# EAGLE schematic PCB (EAGLE 9.6.2)
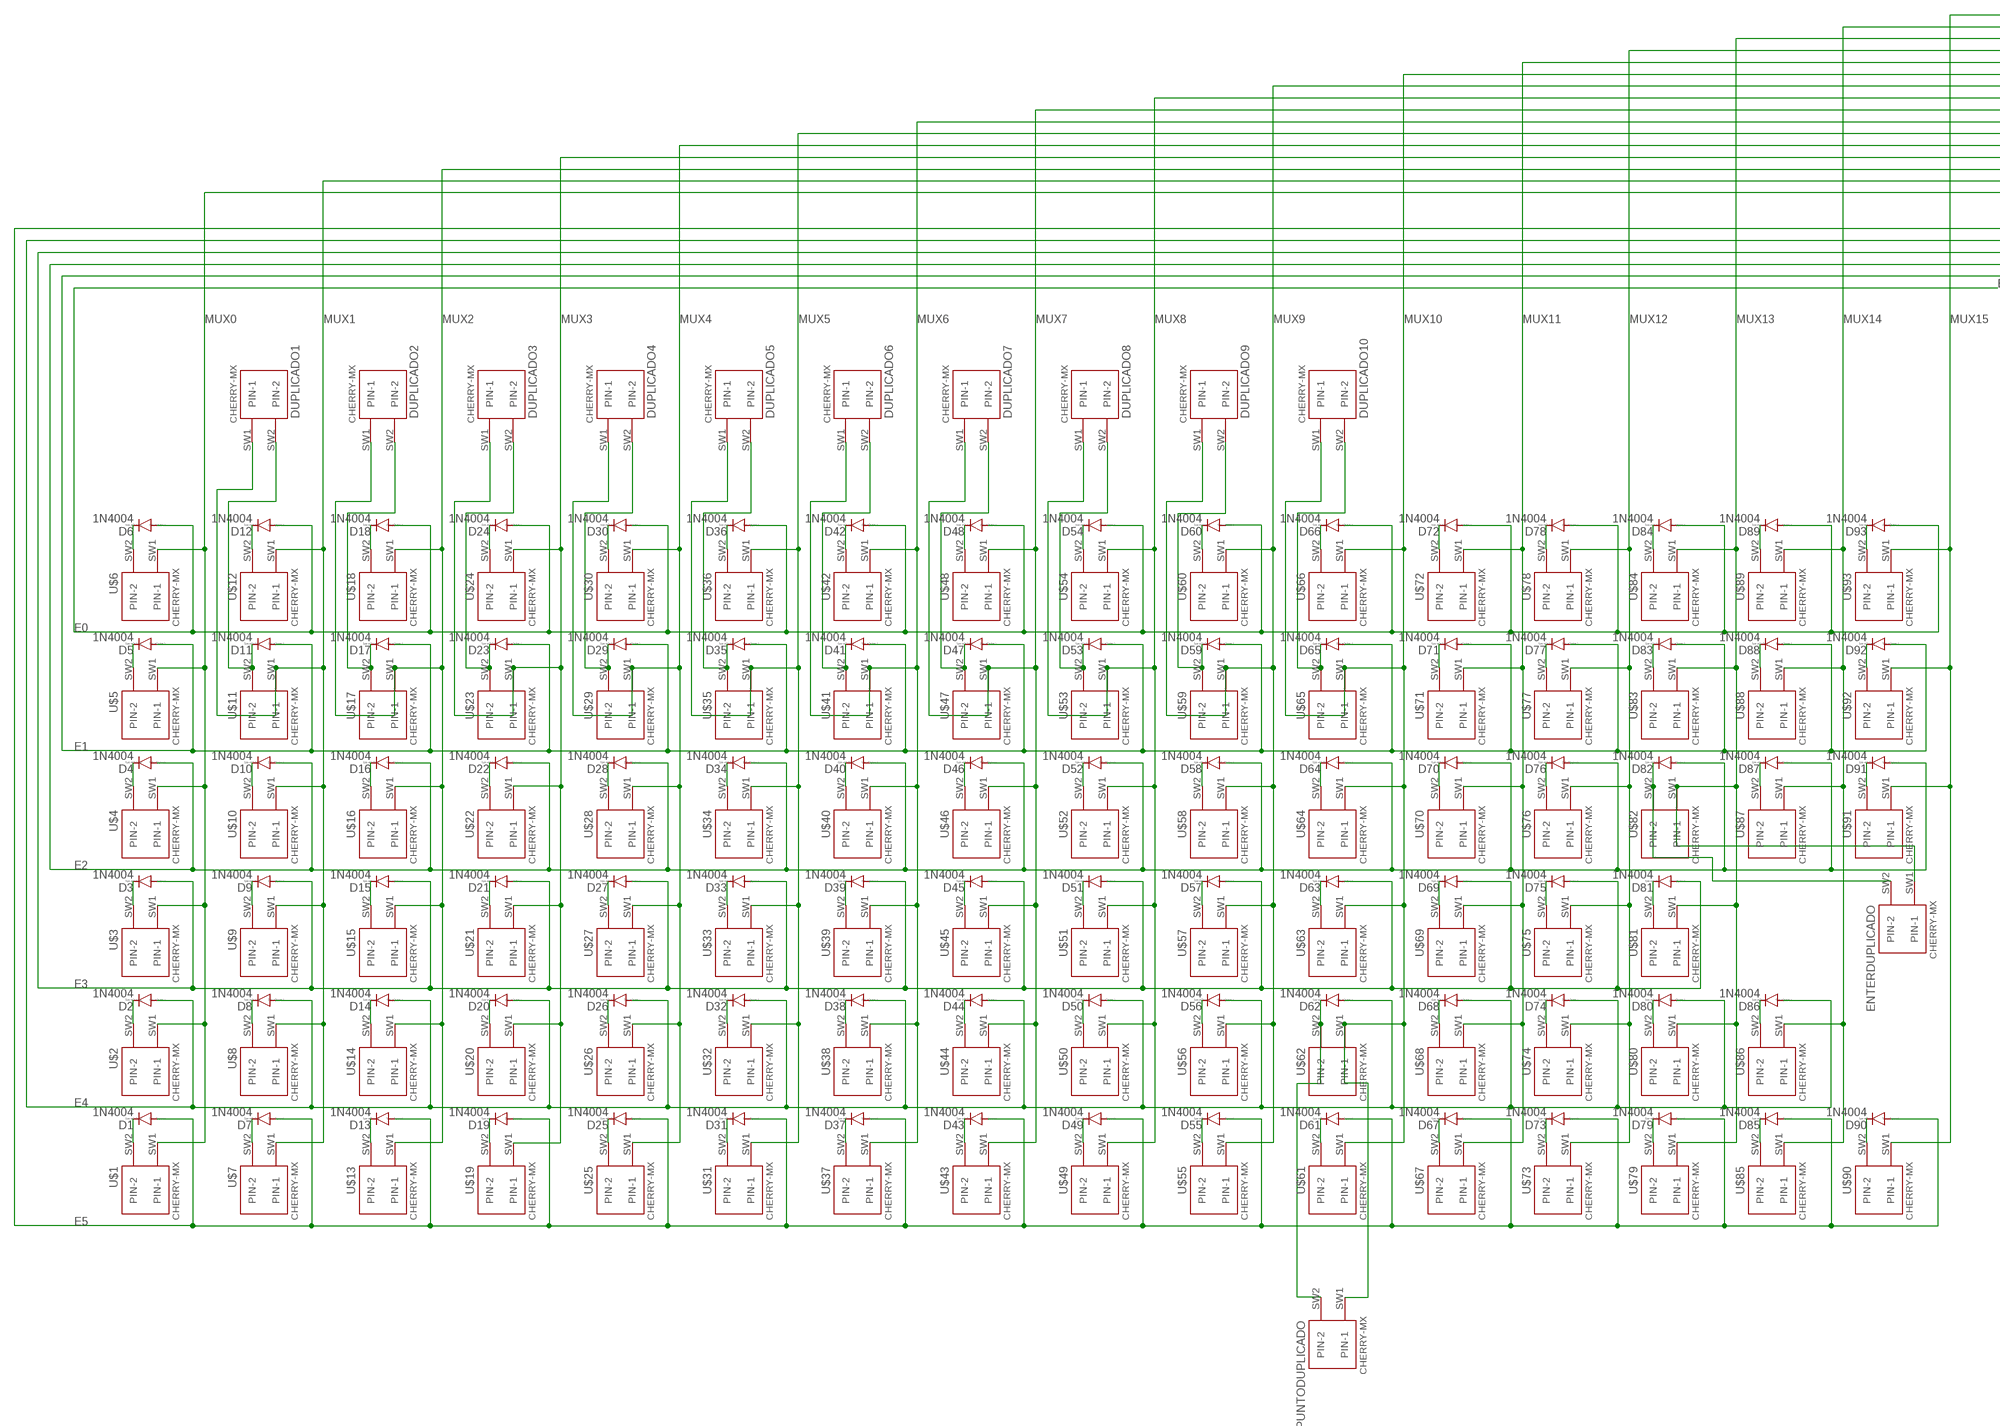
[diagram p0: schematic, sheet 1, part 1 of 2]
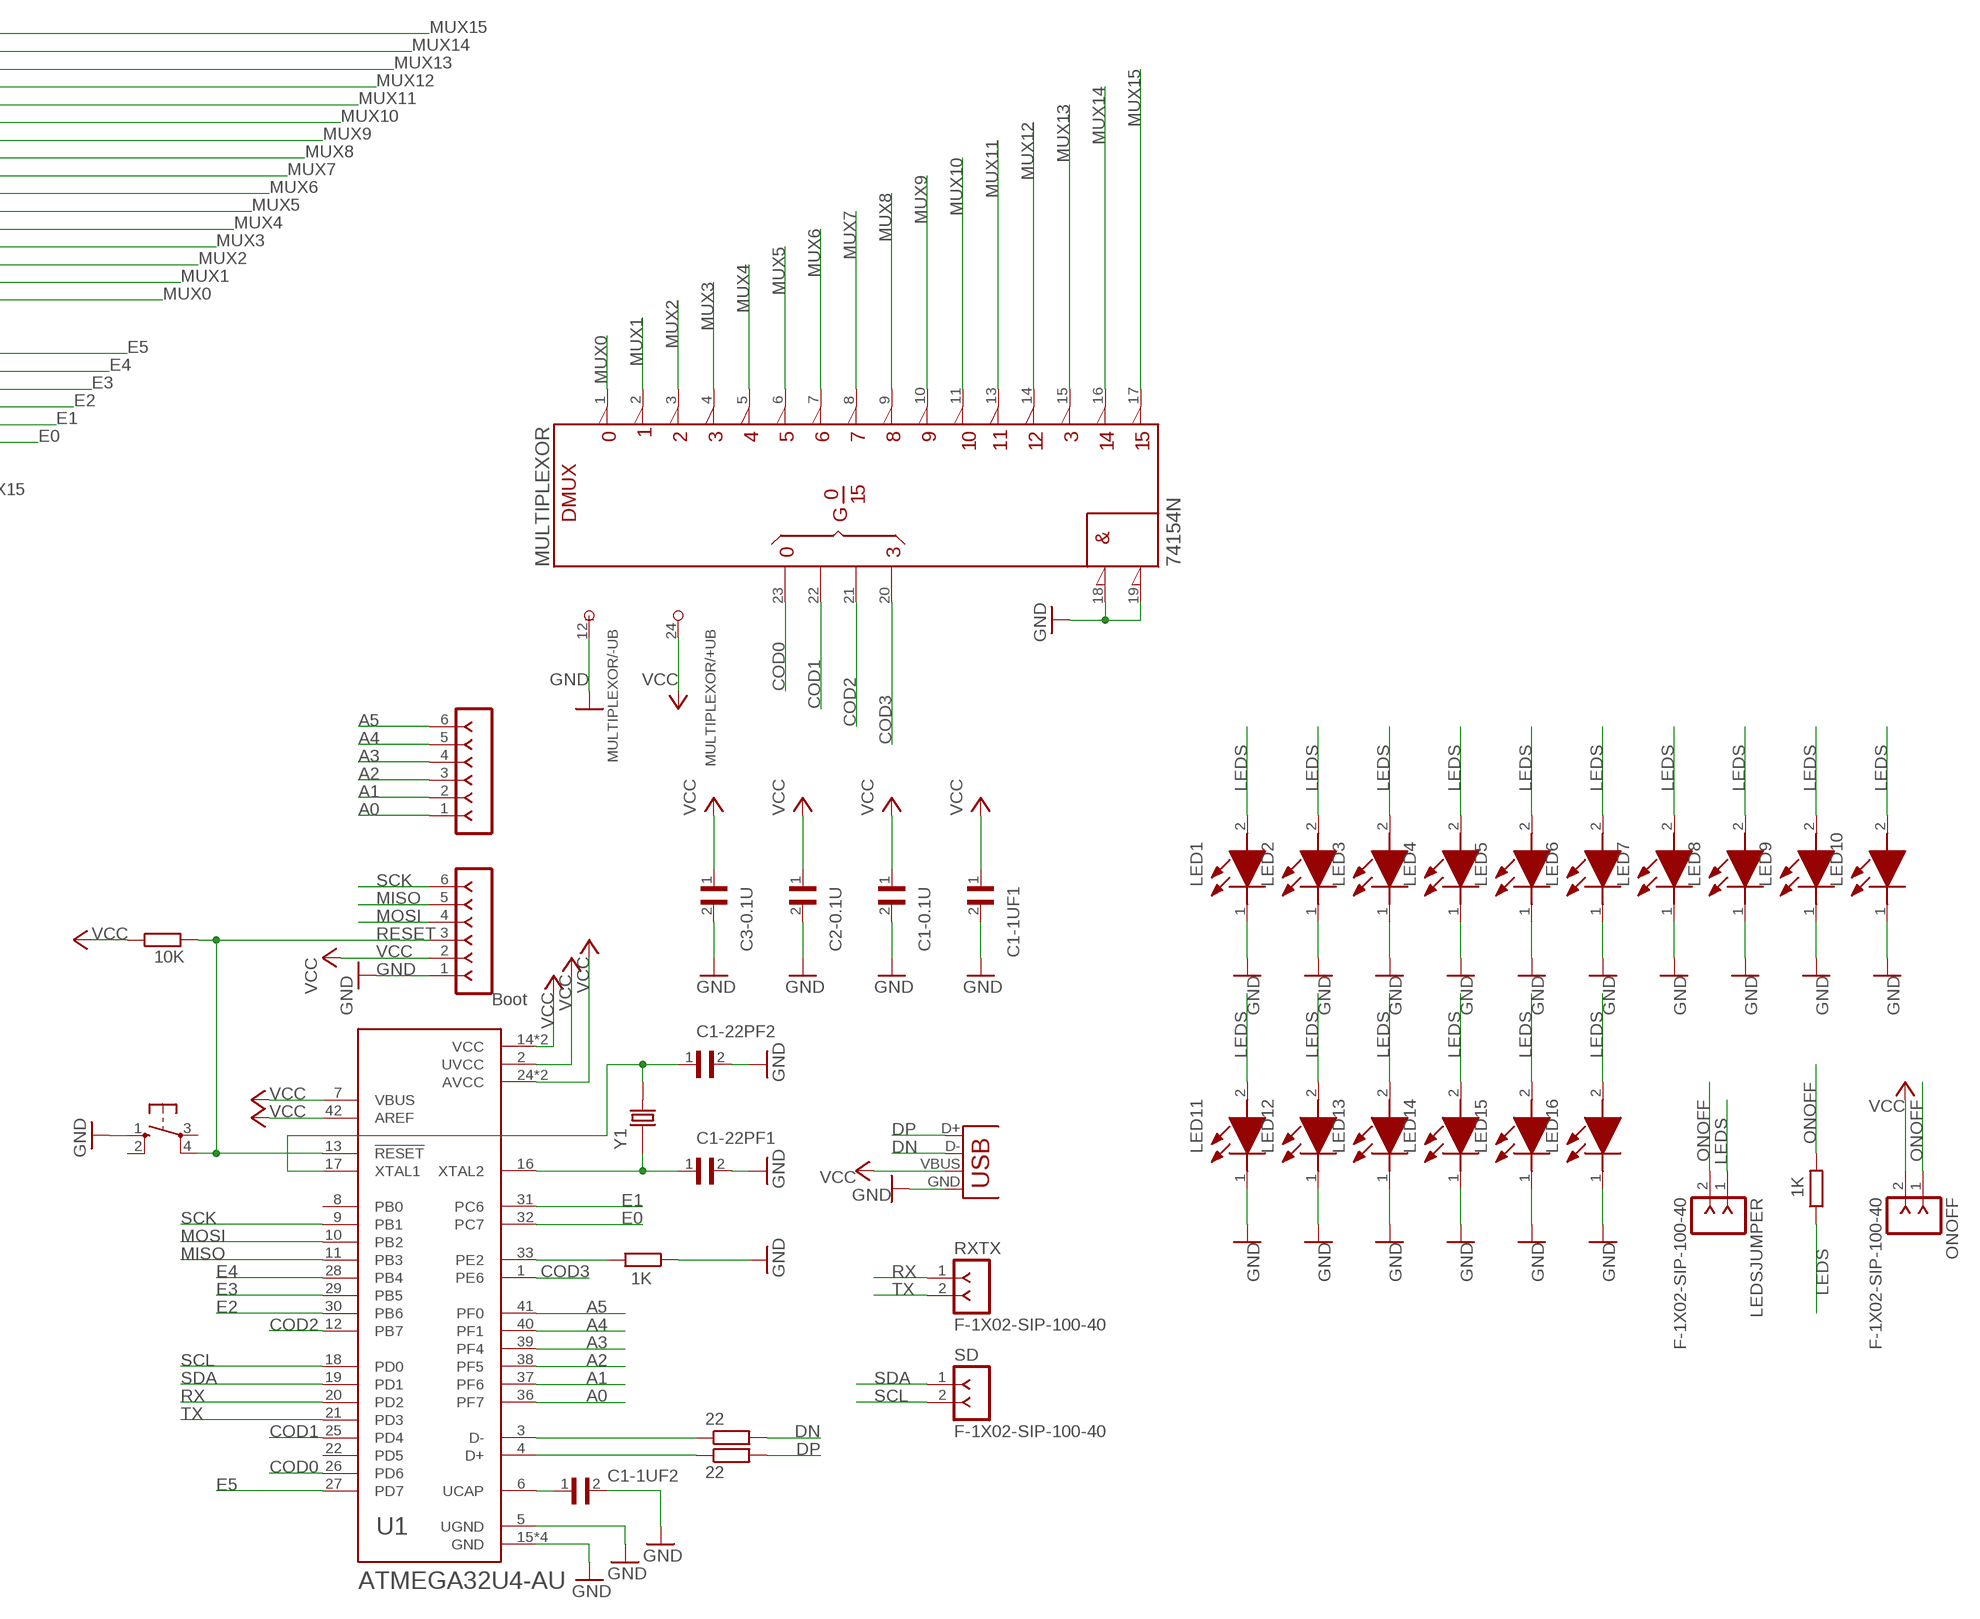
[diagram p1: schematic, sheet 1, part 2 of 2]

## Parts
ANALOG  Boot  F-1X06-SIP-100-32  [SIP-100-06-32]
BUTTON  10-XX  [B3F-10XX]
C1-0.1U  RDE5C1H273J2M1H03A  [CAP_RDE5C1H273J2M1H03A]
C1-1UF1  RDE5C1H273J2M1H03A  [CAP_RDE5C1H273J2M1H03A]
C1-1UF2  RDE5C1H273J2M1H03A  [CAP_RDE5C1H273J2M1H03A]
C1-22PF1  RDE5C1H273J2M1H03A  [CAP_RDE5C1H273J2M1H03A]
C1-22PF2  RDE5C1H273J2M1H03A  [CAP_RDE5C1H273J2M1H03A]
C2-0.1U  RDE5C1H273J2M1H03A  [CAP_RDE5C1H273J2M1H03A]
C3-0.1U  RDE5C1H273J2M1H03A  [CAP_RDE5C1H273J2M1H03A]
D1  1N4004  [DO41-10]
D2  1N4004  [DO41-10]
D3  1N4004  [DO41-10]
D4  1N4004  [DO41-10]
D5  1N4004  [DO41-10]
D6  1N4004  [DO41-10]
D7  1N4004  [DO41-10]
D8  1N4004  [DO41-10]
D9  1N4004  [DO41-10]
D10  1N4004  [DO41-10]
D11  1N4004  [DO41-10]
D12  1N4004  [DO41-10]
D13  1N4004  [DO41-10]
D14  1N4004  [DO41-10]
D15  1N4004  [DO41-10]
D16  1N4004  [DO41-10]
D17  1N4004  [DO41-10]
D18  1N4004  [DO41-10]
D19  1N4004  [DO41-10]
D20  1N4004  [DO41-10]
D21  1N4004  [DO41-10]
D22  1N4004  [DO41-10]
D23  1N4004  [DO41-10]
D24  1N4004  [DO41-10]
D25  1N4004  [DO41-10]
D26  1N4004  [DO41-10]
D27  1N4004  [DO41-10]
D28  1N4004  [DO41-10]
D29  1N4004  [DO41-10]
D30  1N4004  [DO41-10]
D31  1N4004  [DO41-10]
D32  1N4004  [DO41-10]
D33  1N4004  [DO41-10]
D34  1N4004  [DO41-10]
D35  1N4004  [DO41-10]
D36  1N4004  [DO41-10]
D37  1N4004  [DO41-10]
D38  1N4004  [DO41-10]
D39  1N4004  [DO41-10]
D40  1N4004  [DO41-10]
D41  1N4004  [DO41-10]
D42  1N4004  [DO41-10]
D43  1N4004  [DO41-10]
D44  1N4004  [DO41-10]
D45  1N4004  [DO41-10]
D46  1N4004  [DO41-10]
D47  1N4004  [DO41-10]
D48  1N4004  [DO41-10]
D49  1N4004  [DO41-10]
D50  1N4004  [DO41-10]
D51  1N4004  [DO41-10]
D52  1N4004  [DO41-10]
D53  1N4004  [DO41-10]
D54  1N4004  [DO41-10]
D55  1N4004  [DO41-10]
D56  1N4004  [DO41-10]
D57  1N4004  [DO41-10]
D58  1N4004  [DO41-10]
D59  1N4004  [DO41-10]
D60  1N4004  [DO41-10]
D61  1N4004  [DO41-10]
D62  1N4004  [DO41-10]
D63  1N4004  [DO41-10]
D64  1N4004  [DO41-10]
D65  1N4004  [DO41-10]
D66  1N4004  [DO41-10]
D67  1N4004  [DO41-10]
D68  1N4004  [DO41-10]
D69  1N4004  [DO41-10]
D70  1N4004  [DO41-10]
D71  1N4004  [DO41-10]
D72  1N4004  [DO41-10]
D73  1N4004  [DO41-10]
D74  1N4004  [DO41-10]
D75  1N4004  [DO41-10]
D76  1N4004  [DO41-10]
D77  1N4004  [DO41-10]
D78  1N4004  [DO41-10]
D79  1N4004  [DO41-10]
D80  1N4004  [DO41-10]
D81  1N4004  [DO41-10]
D82  1N4004  [DO41-10]
D83  1N4004  [DO41-10]
D84  1N4004  [DO41-10]
D85  1N4004  [DO41-10]
D86  1N4004  [DO41-10]
D87  1N4004  [DO41-10]
D88  1N4004  [DO41-10]
D89  1N4004  [DO41-10]
D90  1N4004  [DO41-10]
D91  1N4004  [DO41-10]
D92  1N4004  [DO41-10]
D93  1N4004  [DO41-10]
DUPLICADO1  CHERRY-MX  [CHERRY-MX]
DUPLICADO2  CHERRY-MX  [CHERRY-MX]
DUPLICADO3  CHERRY-MX  [CHERRY-MX]
DUPLICADO4  CHERRY-MX  [CHERRY-MX]
DUPLICADO5  CHERRY-MX  [CHERRY-MX]
DUPLICADO6  CHERRY-MX  [CHERRY-MX]
DUPLICADO7  CHERRY-MX  [CHERRY-MX]
DUPLICADO8  CHERRY-MX  [CHERRY-MX]
DUPLICADO9  CHERRY-MX  [CHERRY-MX]
DUPLICADO10  CHERRY-MX  [CHERRY-MX]
ENTERDUPLICADO  CHERRY-MX  [CHERRY-MX]
J3  Boot  F-1X06-SIP-100-32  [SIP-100-06-32]
LED1  ASMM-CA03-AS402  [LEDM3528X200N]
LED2  ASMM-CA03-AS402  [LEDM3528X200N]
LED3  ASMM-CA03-AS402  [LEDM3528X200N]
LED4  ASMM-CA03-AS402  [LEDM3528X200N]
LED5  ASMM-CA03-AS402  [LEDM3528X200N]
LED6  ASMM-CA03-AS402  [LEDM3528X200N]
LED7  ASMM-CA03-AS402  [LEDM3528X200N]
LED8  ASMM-CA03-AS402  [LEDM3528X200N]
LED9  ASMM-CA03-AS402  [LEDM3528X200N]
LED10  ASMM-CA03-AS402  [LEDM3528X200N]
LED11  ASMM-CA03-AS402  [LEDM3528X200N]
LED12  ASMM-CA03-AS402  [LEDM3528X200N]
LED13  ASMM-CA03-AS402  [LEDM3528X200N]
LED14  ASMM-CA03-AS402  [LEDM3528X200N]
LED15  ASMM-CA03-AS402  [LEDM3528X200N]
LED16  ASMM-CA03-AS402  [LEDM3528X200N]
LEDSJUMPER  F-1X02-SIP-100-40  [SIP-100-02-40]
MULTIPLEXOR  74154N  [DIL24-3]
ONOFF  F-1X02-SIP-100-40  [SIP-100-02-40]
PUNTODUPLICADO  CHERRY-MX  [CHERRY-MX]
R1  22  R-EU_0204/7  [0204/7]
R2  22  R-EU_0204/7  [0204/7]
R3  1K  R-EU_0204/7  [0204/7]
R4  1K  R-EU_0204/7  [0204/7]
R5  10K  R-EU_0204/7  [0204/7]
RXTX  F-1X02-SIP-100-40  [SIP-100-02-40]
SD  F-1X02-SIP-100-40  [SIP-100-02-40]
U1  ATMEGA32U4-AU  [QFP80P1200X1200X120-44N]
U$1  CHERRY-MX  [CHERRY-MX]
U$2  CHERRY-MX  [CHERRY-MX]
U$3  CHERRY-MX  [CHERRY-MX]
U$4  CHERRY-MX  [CHERRY-MX]
U$5  CHERRY-MX  [CHERRY-MX]
U$6  CHERRY-MX  [CHERRY-MX]
U$7  CHERRY-MX  [CHERRY-MX]
U$8  CHERRY-MX  [CHERRY-MX]
U$9  CHERRY-MX  [CHERRY-MX]
U$10  CHERRY-MX  [CHERRY-MX]
U$11  CHERRY-MX  [CHERRY-MX]
U$12  CHERRY-MX  [CHERRY-MX]
U$13  CHERRY-MX  [CHERRY-MX]
U$14  CHERRY-MX  [CHERRY-MX]
U$15  CHERRY-MX  [CHERRY-MX]
U$16  CHERRY-MX  [CHERRY-MX]
U$17  CHERRY-MX  [CHERRY-MX]
U$18  CHERRY-MX  [CHERRY-MX]
U$19  CHERRY-MX  [CHERRY-MX]
U$20  CHERRY-MX  [CHERRY-MX]
U$21  CHERRY-MX  [CHERRY-MX]
U$22  CHERRY-MX  [CHERRY-MX]
U$23  CHERRY-MX  [CHERRY-MX]
U$24  CHERRY-MX  [CHERRY-MX]
U$25  CHERRY-MX  [CHERRY-MX]
U$26  CHERRY-MX  [CHERRY-MX]
U$27  CHERRY-MX  [CHERRY-MX]
U$28  CHERRY-MX  [CHERRY-MX]
U$29  CHERRY-MX  [CHERRY-MX]
U$30  CHERRY-MX  [CHERRY-MX]
U$31  CHERRY-MX  [CHERRY-MX]
U$32  CHERRY-MX  [CHERRY-MX]
U$33  CHERRY-MX  [CHERRY-MX]
U$34  CHERRY-MX  [CHERRY-MX]
U$35  CHERRY-MX  [CHERRY-MX]
U$36  CHERRY-MX  [CHERRY-MX]
U$37  CHERRY-MX  [CHERRY-MX]
U$38  CHERRY-MX  [CHERRY-MX]
U$39  CHERRY-MX  [CHERRY-MX]
U$40  CHERRY-MX  [CHERRY-MX]
U$41  CHERRY-MX  [CHERRY-MX]
U$42  CHERRY-MX  [CHERRY-MX]
U$43  CHERRY-MX  [CHERRY-MX]
U$44  CHERRY-MX  [CHERRY-MX]
U$45  CHERRY-MX  [CHERRY-MX]
U$46  CHERRY-MX  [CHERRY-MX]
U$47  CHERRY-MX  [CHERRY-MX]
U$48  CHERRY-MX  [CHERRY-MX]
U$49  CHERRY-MX  [CHERRY-MX]
U$50  CHERRY-MX  [CHERRY-MX]
U$51  CHERRY-MX  [CHERRY-MX]
U$52  CHERRY-MX  [CHERRY-MX]
U$53  CHERRY-MX  [CHERRY-MX]
U$54  CHERRY-MX  [CHERRY-MX]
U$55  CHERRY-MX  [CHERRY-MX]
U$56  CHERRY-MX  [CHERRY-MX]
U$57  CHERRY-MX  [CHERRY-MX]
U$58  CHERRY-MX  [CHERRY-MX]
U$59  CHERRY-MX  [CHERRY-MX]
U$60  CHERRY-MX  [CHERRY-MX]
U$61  CHERRY-MX  [CHERRY-MX]
U$62  CHERRY-MX  [CHERRY-MX]
U$63  CHERRY-MX  [CHERRY-MX]
U$64  CHERRY-MX  [CHERRY-MX]
U$65  CHERRY-MX  [CHERRY-MX]
U$66  CHERRY-MX  [CHERRY-MX]
U$67  CHERRY-MX  [CHERRY-MX]
U$68  CHERRY-MX  [CHERRY-MX]
U$69  CHERRY-MX  [CHERRY-MX]
U$70  CHERRY-MX  [CHERRY-MX]
U$71  CHERRY-MX  [CHERRY-MX]
U$72  CHERRY-MX  [CHERRY-MX]
U$73  CHERRY-MX  [CHERRY-MX]
U$74  CHERRY-MX  [CHERRY-MX]
U$75  CHERRY-MX  [CHERRY-MX]
U$76  CHERRY-MX  [CHERRY-MX]
U$77  CHERRY-MX  [CHERRY-MX]
U$78  CHERRY-MX  [CHERRY-MX]
U$79  CHERRY-MX  [CHERRY-MX]
U$80  CHERRY-MX  [CHERRY-MX]
U$81  CHERRY-MX  [CHERRY-MX]
U$82  CHERRY-MX  [CHERRY-MX]
U$83  CHERRY-MX  [CHERRY-MX]
U$84  CHERRY-MX  [CHERRY-MX]
U$85  CHERRY-MX  [CHERRY-MX]
U$86  CHERRY-MX  [CHERRY-MX]
U$87  CHERRY-MX  [CHERRY-MX]
U$88  CHERRY-MX  [CHERRY-MX]
U$89  CHERRY-MX  [CHERRY-MX]
U$90  CHERRY-MX  [CHERRY-MX]
U$91  CHERRY-MX  [CHERRY-MX]
U$92  CHERRY-MX  [CHERRY-MX]
U$93  CHERRY-MX  [CHERRY-MX]
X2  USB-A-H  [USB-A-H]
Y1  ECS-160-20-4X  [XTAL_ECS-160-20-4X]

## Nets
A0: ANALOG.1 U1.36(PF7)
A1: ANALOG.2 U1.37(PF6)
A2: ANALOG.3 U1.38(PF5)
A3: ANALOG.4 U1.39(PF4)
A4: ANALOG.5 U1.40(PF1)
A5: ANALOG.6 U1.41(PF0)
COD0: MULTIPLEXOR.23(A) U1.26(PD6)
COD1: MULTIPLEXOR.22(B) U1.25(PD4)
COD2: MULTIPLEXOR.21(C) U1.12(PB7)
COD3: MULTIPLEXOR.20(D) U1.1(PE6)
D+: R1.1 U1.4(D+)
D-: R2.1 U1.3(D-)
DN: R2.2 X2.D-
DP: R1.2 X2.D+
E0: D6.A D12.A D18.A D24.A D30.A D36.A D42.A D48.A D54.A D60.A D66.A D72.A D78.A D84.A D89.A D93.A U1.32(PC7)
E1: D5.A D11.A D17.A D23.A D29.A D35.A D41.A D47.A D53.A D59.A D65.A D71.A D77.A D83.A D88.A D92.A U1.31(PC6)
E2: D4.A D10.A D16.A D22.A D28.A D34.A D40.A D46.A D52.A D58.A D64.A D70.A D76.A D82.A D87.A D91.A U1.30(PB6)
E3: D3.A D9.A D15.A D21.A D27.A D33.A D39.A D45.A D51.A D57.A D63.A D69.A D75.A D81.A U1.29(PB5)
E4: D2.A D8.A D14.A D20.A D26.A D32.A D38.A D44.A D50.A D56.A D62.A D68.A D74.A D80.A D86.A U1.28(PB4)
E5: D1.A D7.A D13.A D19.A D25.A D31.A D37.A D43.A D49.A D55.A D61.A D67.A D73.A D79.A D85.A D90.A U1.27(PD7)
GND [vcc]: BUTTON.1(S) C1-0.1U.2 C1-1UF1.2 C1-1UF2.2 C1-22PF1.2 C1-22PF2.2 C2-0.1U.2 C3-0.1U.2 J3.1 LED1.1(K) LED2.1(K) LED3.1(K) LED4.1(K) LED5.1(K) LED6.1(K) LED7.1(K) LED8.1(K) LED9.1(K) LED10.1(K) LED11.1(K) LED12.1(K) LED13.1(K) LED14.1(K) LED15.1(K) LED16.1(K) MULTIPLEXOR.12(-UB) MULTIPLEXOR.18(!G1) MULTIPLEXOR.19(!G2) R4.1 U1.5(UGND) U1.15(GND) U1.23(GND) U1.35(GND) U1.43(GND) X2.GND
LEDS: LED1.2(A) LED2.2(A) LED3.2(A) LED4.2(A) LED5.2(A) LED6.2(A) LED7.2(A) LED8.2(A) LED9.2(A) LED10.2(A) LED11.2(A) LED12.2(A) LED13.2(A) LED14.2(A) LED15.2(A) LED16.2(A) LEDSJUMPER.1 R3.1
MISO: J3.5 U1.11(PB3)
MOSI: J3.4 U1.10(PB2)
MUX0: MULTIPLEXOR.1 U$1.SW1(PIN-1) U$2.SW1(PIN-1) U$3.SW1(PIN-1) U$4.SW1(PIN-1) U$5.SW1(PIN-1) U$6.SW1(PIN-1)
MUX1: DUPLICADO1.SW1(PIN-1) MULTIPLEXOR.2 U$7.SW1(PIN-1) U$8.SW1(PIN-1) U$9.SW1(PIN-1) U$10.SW1(PIN-1) U$11.SW1(PIN-1) U$12.SW1(PIN-1)
MUX2: DUPLICADO2.SW1(PIN-1) MULTIPLEXOR.3 U$13.SW1(PIN-1) U$14.SW1(PIN-1) U$15.SW1(PIN-1) U$16.SW1(PIN-1) U$17.SW1(PIN-1) U$18.SW1(PIN-1)
MUX3: DUPLICADO3.SW1(PIN-1) MULTIPLEXOR.4 U$19.SW1(PIN-1) U$20.SW1(PIN-1) U$21.SW1(PIN-1) U$22.SW1(PIN-1) U$23.SW1(PIN-1) U$24.SW1(PIN-1)
MUX4: DUPLICADO4.SW1(PIN-1) MULTIPLEXOR.5 U$25.SW1(PIN-1) U$26.SW1(PIN-1) U$27.SW1(PIN-1) U$28.SW1(PIN-1) U$29.SW1(PIN-1) U$30.SW1(PIN-1)
MUX5: DUPLICADO5.SW1(PIN-1) MULTIPLEXOR.6 U$31.SW1(PIN-1) U$32.SW1(PIN-1) U$33.SW1(PIN-1) U$34.SW1(PIN-1) U$35.SW1(PIN-1) U$36.SW1(PIN-1)
MUX6: DUPLICADO6.SW1(PIN-1) MULTIPLEXOR.7 U$37.SW1(PIN-1) U$38.SW1(PIN-1) U$39.SW1(PIN-1) U$40.SW1(PIN-1) U$41.SW1(PIN-1) U$42.SW1(PIN-1)
MUX7: DUPLICADO7.SW1(PIN-1) MULTIPLEXOR.8 U$43.SW1(PIN-1) U$44.SW1(PIN-1) U$45.SW1(PIN-1) U$46.SW1(PIN-1) U$47.SW1(PIN-1) U$48.SW1(PIN-1)
MUX8: DUPLICADO8.SW1(PIN-1) MULTIPLEXOR.9 U$49.SW1(PIN-1) U$50.SW1(PIN-1) U$51.SW1(PIN-1) U$52.SW1(PIN-1) U$53.SW1(PIN-1) U$54.SW1(PIN-1)
MUX9: DUPLICADO9.SW1(PIN-1) MULTIPLEXOR.10 U$55.SW1(PIN-1) U$56.SW1(PIN-1) U$57.SW1(PIN-1) U$58.SW1(PIN-1) U$59.SW1(PIN-1) U$60.SW1(PIN-1)
MUX10: DUPLICADO10.SW1(PIN-1) MULTIPLEXOR.11 PUNTODUPLICADO.SW1(PIN-1) U$61.SW1(PIN-1) U$62.SW1(PIN-1) U$63.SW1(PIN-1) U$64.SW1(PIN-1) U$65.SW1(PIN-1) U$66.SW1(PIN-1)
MUX11: MULTIPLEXOR.13 U$67.SW1(PIN-1) U$68.SW1(PIN-1) U$69.SW1(PIN-1) U$70.SW1(PIN-1) U$71.SW1(PIN-1) U$72.SW1(PIN-1)
MUX12: MULTIPLEXOR.14 U$73.SW1(PIN-1) U$74.SW1(PIN-1) U$75.SW1(PIN-1) U$76.SW1(PIN-1) U$77.SW1(PIN-1) U$78.SW1(PIN-1)
MUX13: ENTERDUPLICADO.SW1(PIN-1) MULTIPLEXOR.15 U$79.SW1(PIN-1) U$80.SW1(PIN-1) U$81.SW1(PIN-1) U$82.SW1(PIN-1) U$83.SW1(PIN-1) U$84.SW1(PIN-1)
MUX14: MULTIPLEXOR.16 U$85.SW1(PIN-1) U$86.SW1(PIN-1) U$87.SW1(PIN-1) U$88.SW1(PIN-1) U$89.SW1(PIN-1)
MUX15: MULTIPLEXOR.17 U$90.SW1(PIN-1) U$91.SW1(PIN-1) U$92.SW1(PIN-1) U$93.SW1(PIN-1)
N$1: D4.C U$4.SW2(PIN-2)
N$2: D10.C U$10.SW2(PIN-2)
N$3: D16.C U$16.SW2(PIN-2)
N$4: D22.C U$22.SW2(PIN-2)
N$5: D5.C U$5.SW2(PIN-2)
N$6: D6.C U$6.SW2(PIN-2)
N$7: D28.C U$28.SW2(PIN-2)
N$8: D34.C U$34.SW2(PIN-2)
N$9: D40.C U$40.SW2(PIN-2)
N$10: D46.C U$46.SW2(PIN-2)
N$11: D11.C DUPLICADO1.SW2(PIN-2) U$11.SW2(PIN-2)
N$12: D12.C U$12.SW2(PIN-2)
N$13: D52.C U$52.SW2(PIN-2)
N$14: D58.C U$58.SW2(PIN-2)
N$15: D64.C U$64.SW2(PIN-2)
N$16: D70.C U$70.SW2(PIN-2)
N$17: D17.C DUPLICADO2.SW2(PIN-2) U$17.SW2(PIN-2)
N$18: D18.C U$18.SW2(PIN-2)
N$19: D76.C U$76.SW2(PIN-2)
N$20: D87.C U$87.SW2(PIN-2)
N$21: D91.C U$91.SW2(PIN-2)
N$22: D81.C U$81.SW2(PIN-2)
N$23: D23.C DUPLICADO3.SW2(PIN-2) U$23.SW2(PIN-2)
N$24: D24.C U$24.SW2(PIN-2)
N$25: D75.C U$75.SW2(PIN-2)
N$26: D69.C U$69.SW2(PIN-2)
N$27: D63.C U$63.SW2(PIN-2)
N$28: D57.C U$57.SW2(PIN-2)
N$29: D29.C DUPLICADO4.SW2(PIN-2) U$29.SW2(PIN-2)
N$30: D30.C U$30.SW2(PIN-2)
N$37: D51.C U$51.SW2(PIN-2)
N$38: D45.C U$45.SW2(PIN-2)
N$39: D39.C U$39.SW2(PIN-2)
N$40: D33.C U$33.SW2(PIN-2)
N$41: D35.C DUPLICADO5.SW2(PIN-2) U$35.SW2(PIN-2)
N$42: D36.C U$36.SW2(PIN-2)
N$43: D27.C U$27.SW2(PIN-2)
N$44: D21.C U$21.SW2(PIN-2)
N$45: D15.C U$15.SW2(PIN-2)
N$46: D9.C U$9.SW2(PIN-2)
N$47: D41.C DUPLICADO6.SW2(PIN-2) U$41.SW2(PIN-2)
N$48: D42.C U$42.SW2(PIN-2)
N$49: D3.C U$3.SW2(PIN-2)
N$50: D2.C U$2.SW2(PIN-2)
N$51: D8.C U$8.SW2(PIN-2)
N$52: D14.C U$14.SW2(PIN-2)
N$53: D47.C DUPLICADO7.SW2(PIN-2) U$47.SW2(PIN-2)
N$54: D48.C U$48.SW2(PIN-2)
N$55: D20.C U$20.SW2(PIN-2)
N$56: D26.C U$26.SW2(PIN-2)
N$57: D32.C U$32.SW2(PIN-2)
N$58: D38.C U$38.SW2(PIN-2)
N$59: D53.C DUPLICADO8.SW2(PIN-2) U$53.SW2(PIN-2)
N$60: D54.C U$54.SW2(PIN-2)
N$61: D44.C U$44.SW2(PIN-2)
N$62: D50.C U$50.SW2(PIN-2)
N$63: D56.C U$56.SW2(PIN-2)
N$64: D68.C U$68.SW2(PIN-2)
N$65: D59.C DUPLICADO9.SW2(PIN-2) U$59.SW2(PIN-2)
N$66: D60.C U$60.SW2(PIN-2)
N$67: D74.C U$74.SW2(PIN-2)
N$68: D62.C PUNTODUPLICADO.SW2(PIN-2) U$62.SW2(PIN-2)
N$69: D80.C U$80.SW2(PIN-2)
N$70: D86.C U$86.SW2(PIN-2)
N$71: D65.C DUPLICADO10.SW2(PIN-2) U$65.SW2(PIN-2)
N$72: D66.C U$66.SW2(PIN-2)
N$73: D90.C U$90.SW2(PIN-2)
N$74: D85.C U$85.SW2(PIN-2)
N$75: D79.C U$79.SW2(PIN-2)
N$76: D73.C U$73.SW2(PIN-2)
N$77: D71.C U$71.SW2(PIN-2)
N$78: D72.C U$72.SW2(PIN-2)
N$79: D67.C U$67.SW2(PIN-2)
N$80: D61.C U$61.SW2(PIN-2)
N$81: D55.C U$55.SW2(PIN-2)
N$82: D49.C U$49.SW2(PIN-2)
N$83: D77.C U$77.SW2(PIN-2)
N$84: D78.C U$78.SW2(PIN-2)
N$85: D43.C U$43.SW2(PIN-2)
N$86: D37.C U$37.SW2(PIN-2)
N$87: D31.C U$31.SW2(PIN-2)
N$88: D82.C ENTERDUPLICADO.SW2(PIN-2) U$82.SW2(PIN-2)
N$89: D83.C U$83.SW2(PIN-2)
N$90: D84.C U$84.SW2(PIN-2)
N$91: D25.C U$25.SW2(PIN-2)
N$92: D19.C U$19.SW2(PIN-2)
N$93: D13.C U$13.SW2(PIN-2)
N$94: D88.C U$88.SW2(PIN-2)
N$95: D89.C U$89.SW2(PIN-2)
N$96: D7.C U$7.SW2(PIN-2)
N$97: D1.C U$1.SW2(PIN-2)
N$98: D92.C U$92.SW2(PIN-2)
N$99: D93.C U$93.SW2(PIN-2)
ONOFF: LEDSJUMPER.2 ONOFF.1 R3.2
PE2: R4.2 U1.33(PE2)
RESET: BUTTON.4(P1) J3.3 R5.2 U1.13(!RESET)
RX: RXTX.1 U1.20(PD2)
SCK: J3.6 U1.9(PB1)
SCL: SD.2 U1.18(PD0)
SDA: SD.1 U1.19(PD1)
TX: RXTX.2 U1.21(PD3)
UCAP: C1-1UF2.1 U1.6(UCAP)
VCC: C1-0.1U.1 C1-1UF1.1 C2-0.1U.1 C3-0.1U.1 J3.2 MULTIPLEXOR.24(+UB) ONOFF.2 R5.1 U1.2(UVCC) U1.7(VBUS) U1.14(VCC) U1.24(AVCC) U1.34(VCC) U1.42(AREF) U1.44(AVCC) X2.VBUS
XTAL1: C1-22PF2.1 U1.17(XTAL1) Y1.2
XTAL2: C1-22PF1.1 U1.16(XTAL2) Y1.1
Unconnected: BUTTON.2(S1) BUTTON.3(P) U1.8(PB0) U1.22(PD5)

## Library data of the parts
ANALOG J3 = con-headers-jp:F-1X06-: FEMALE HEADER
BUTTON = switch-omron:10-XX: OMRON SWITCH; MPN: B3F-1000; OC_FARNELL: 176432; OC_NEWARK: 36M3542
C1-0.1U C1-1UF1 C1-1UF2 C1-22PF1 C1-22PF2 C2-0.1U C3-0.1U = Capacitor:RDE5C1H273J2M1H03A: Check prices <https://pricing.snapeda.com/parts/RDE5C1H273J2M1H03A/Murata%20Electronics/view-part?ref=eda>; AVAILABILITY: In Stock; DESCRIPTION: Ceramic Capacitor; MF: Murata Electronics; MP: RDE5C1H273J2M1H03A; PACKAGE: NONSTANDARD; PRICE: None
D1-D93 = diode:1N4004: DIODE general purpose rectifier, 1 A
DUPLICADO1-DUPLICADO10 ENTERDUPLICADO PUNTODUPLICADO U$1-U$93 = cherrymx:CHERRY-MX: Cherry MX series keyswitch
LED1-LED16 = ASMM-CA03-AS402:ASMM-CA03-AS402: Standard LEDs - SMD PLCC2, SMD AlInGaP,Amber Source: Datasheet <https://www.mouser.es/datasheet/2/678/ASMM_Cx03_xxxxx_DS107-2497273.pdf>; DESCRIPTION: Standard LEDs - SMD PLCC2, SMD AlInGaP,Amber; HEIGHT: 2mm; MANUFACTURER_NAME: Avago Technologies; MANUFACTURER_PART_NUMBER: ASMM-CA03-AS402
LEDSJUMPER ONOFF RXTX SD = con-headers-jp:F-1X02-: FEMALE HEADER
MULTIPLEXOR = 74ttl-din:74*154: 4-line to 16-line data SELECTOR/MULTIPLEXER; SPICEPREFIX: X
R1-R5 = rcl:R-EU_: RESISTOR, European symbol; SPICEPREFIX: R
U1 = ATMEGA32U4-AU:ATMEGA32U4-AU: ATmega Series 16 MHz 32 KB Flash 2.5 KB SRAM 8-Bit Microcontroller - TQFP-44 Check prices <https://pricing.snapeda.com/parts/ATMEGA32U4-AU/Microchip/view-part?ref=eda>; AVAILABILITY: Not in stock; DESCRIPTION: AVR AVR® ATmega Microcontroller IC 8-Bit 16MHz 32KB (16K x 16) FLASH 44-TQFP (10x10); MF: Microchip; MP: ATMEGA32U4-AU; PACKAGE: TQFP-44 Microchip; PRICE: None
X2 = con-usb:USB: USB Connectors
Y1 = Clock:ECS-160-20-4X: CRYSTAL T/H Check prices <https://pricing.snapeda.com/parts/ECS-160-20-4X/ECS%20Inc./view-part?ref=eda>; AVAILABILITY: In Stock; DESCRIPTION: 16MHz ±30ppm Crystal 20pF 40 Ohms HC-49/US; MF: ECS Inc.; MP: ECS-160-20-4X; PACKAGE: HC-49US ECS Inc.; PRICE: None

## Net classes
0 default: width 0.203 mm